# EAGLE design schéma (EAGLE 8.4.0)
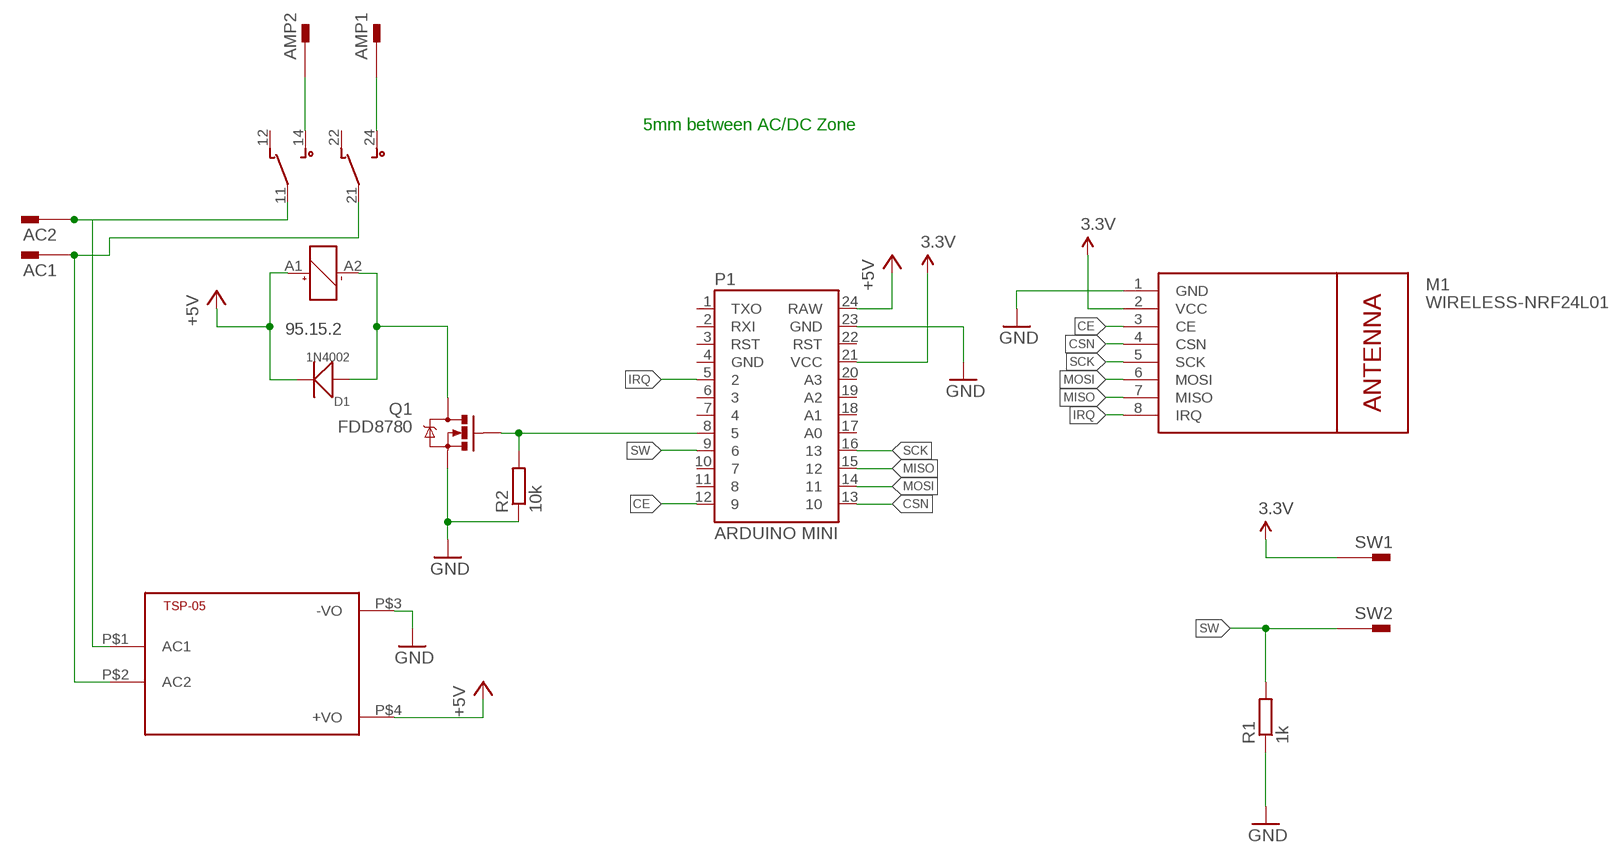
[diagram p0: schematic, sheet 1]

## Parts
AC1  PIN2F061.100  [F061.100]
AC2  PIN2F061.100  [F061.100]
AMP1  PIN2F061.100  [F061.100]
AMP2  PIN2F061.100  [F061.100]
D1  1N4002  DIP-DIODE-50V-1A-1N4001(DO-41)  [DO-41]
M1  WIRELESS-NRF24L01  [WIRELESS-NRF24L01]
P1  ARDUINO MINI  ARDUINO_MINI  [ARDUINO_MINI]
Q1  FDD8780  MOSFET-NCHANNELFDD8780  [DPAK]
R1  1k  R-EU_0207/10  [0207/10]
R2  10k  R-EU_0207/10  [0207/10]
RL1  95.15.2  [95.15.2]
SW1  PIN2F061.100  [F061.100]
SW2  PIN2F061.100  [F061.100]
TSP-05  HKLPM01  [HKLPM01]

## Nets
3.3V: M1.2(VCC) P1.21(VCC) SW1.A1 SW1.A2
+5V: D1.2(-) P1.24(RAW) RL1.A1 TSP-05.P$4(+VO)
CE: M1.3(CE) P1.12
CSN: M1.4(CSN) P1.13
GND: M1.1(GND) P1.23(GND) Q1.3(S) R1.1 R2.1 TSP-05.P$3(-VO)
IRQ: M1.8(IRQ) P1.5
MISO: M1.7(MISO) P1.15
MOSI: M1.6(MOSI) P1.14
N$1: AC1.A1 AC1.A2 RL1.21 TSP-05.P$2(AC2)
N$2: AC2.A1 AC2.A2 RL1.11 TSP-05.P$1(AC1)
N$3: AMP2.A1 AMP2.A2 RL1.14
N$4: AMP1.A1 AMP1.A2 RL1.24
N$5: P1.8 Q1.1(G) R2.2
N$6: D1.1(+) Q1.4(D) RL1.A2
SCK: M1.5(SCK) P1.16
SW: P1.9 R1.2 SW2.A1 SW2.A2
Unconnected: P1.1(TXO) P1.2(RXI) P1.3(RST) P1.4(GND) P1.6 P1.7 P1.10 P1.11 P1.17(A0) P1.18(A1) P1.19(A2) P1.20(A3) P1.22(RST) RL1.12 RL1.22

## Notes on the sheet
- 5mm between AC/DC Zone

## Library data of the parts
AC1 AC2 AMP1 AMP2 SW1 SW2 = con-faston:PIN2: Flachstecker Typ Tyco/Electronics/AMP TAB, FASTON Printed Circuit Board Tabs Source: http://www.buerklin.com, http://catalog.tycoelectronics.com; OC_FARNELL: unknown; OC_NEWARK: unknown
D1 = Seeed-OPL-Diode:DIP-DIODE-50V-1A-1N4001(DO-41): 304010006; MPN: 1N4001; VALUE: 1N4001
M1 = nRF24:WIRELESS-NRF24L01: 2.4 GHz Wireless Module based on NRF24L01 chip More details available here: http://www.electrodragon.com/w/NRF24L01 Click here to find device on ebay.com <http://www.ebay.com/sch/nrf24l01+arduino>
P1 = SparkFun-Boards:ARDUINO_MINI: Arduino Pro Mini footprint
Q1 = SparkFun-DiscreteSemi:MOSFET-NCHANNEL: Common NMOSFET Parts MFG P/N Store ID Prod ID FDD8780 TRANS-09984 SI7820DN TRANS-11055 FDS6630A IC-08089 2N7002PW TRANS-11151 FQP30N06L COM-10213 TRANS-10060 BSS123LT1G TRANS-08345 BSS138 TRANS-00830 BS170 2N7000; PROD_ID: TRANS-09984
R1 R2 = resistor:R-EU_: RESISTOR, European symbol
RL1 = relay_finder:95.15.2: P.C.B. socket suitable for the 40.51 & 40.52 & 40.61 relays
TSP-05 = HKLPM01:HKLPM01

## Board
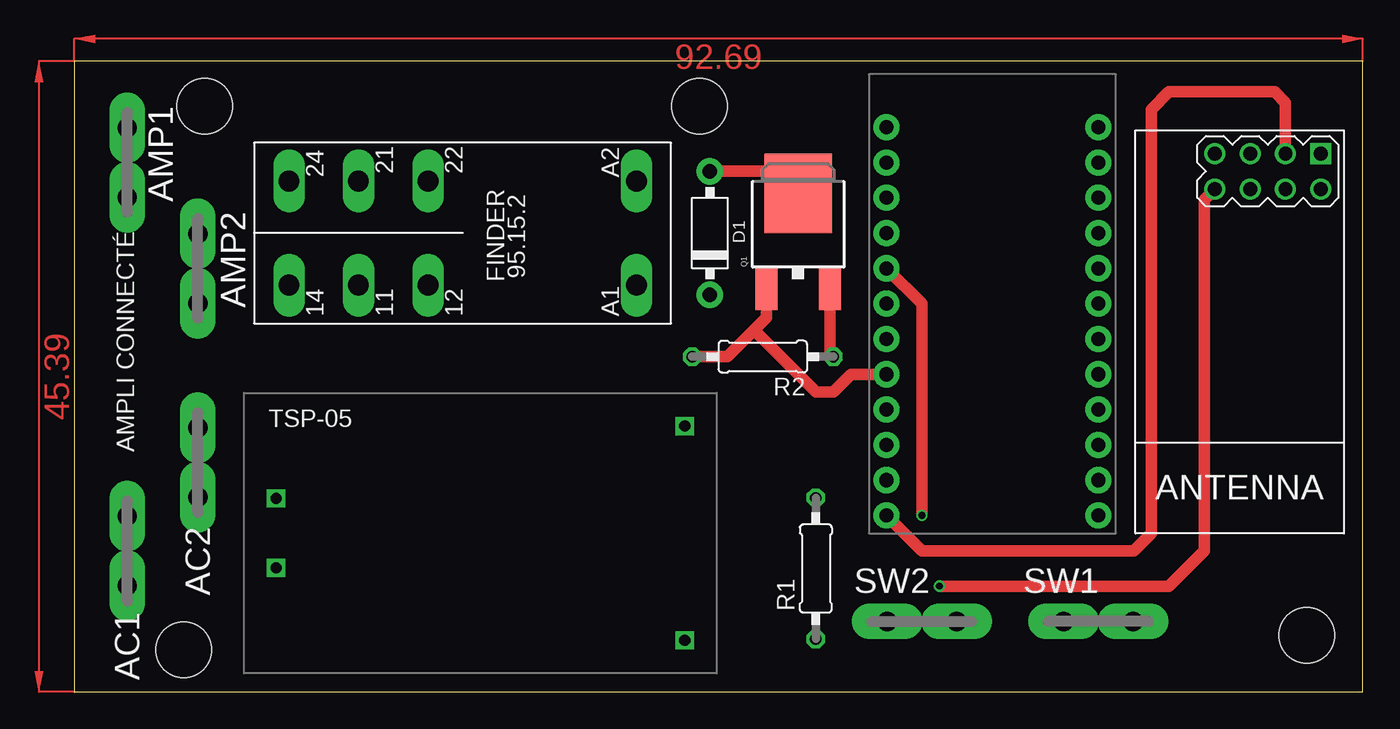
[diagram p1: board, top side]
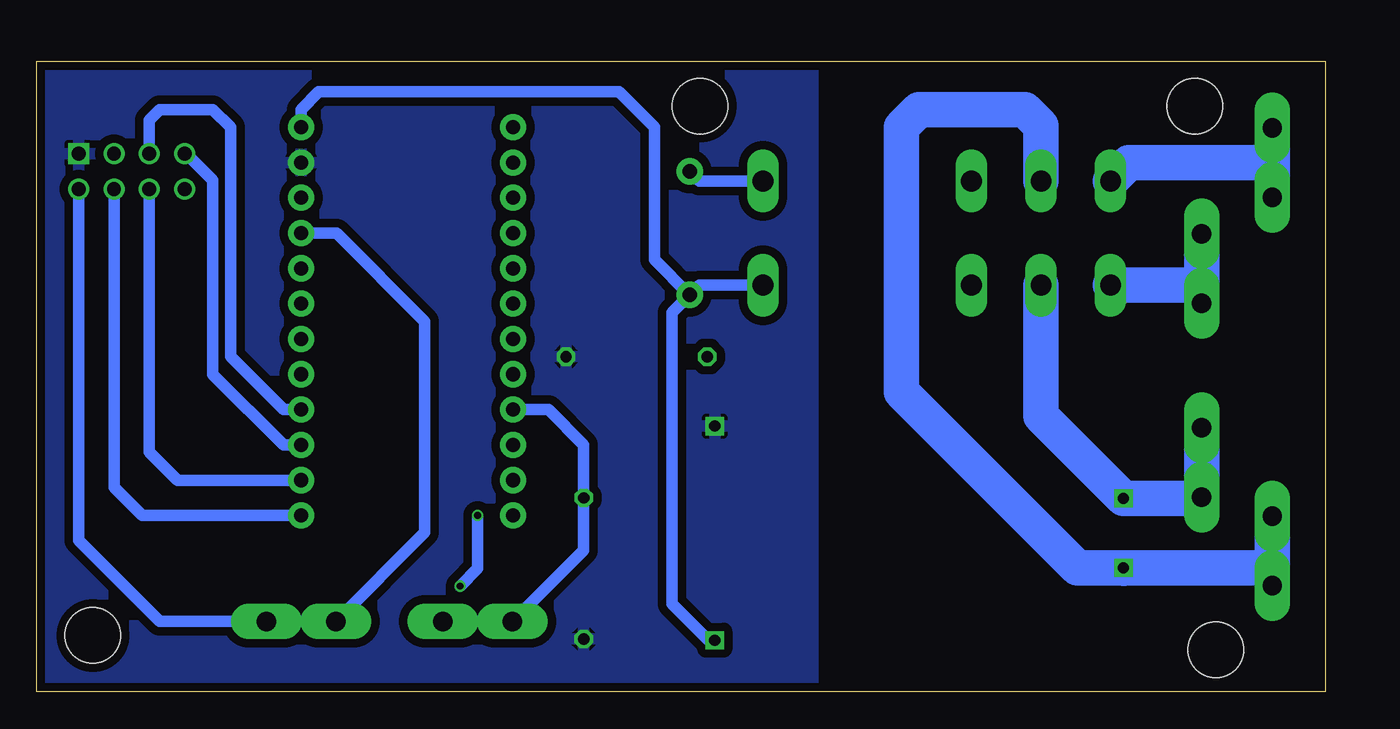
[diagram p2: board, bottom side, seen from below]

Size 92.69 x 45.39 mm. Coordinates in mm from the lower left corner, seen from the top.
Outline: 0,0 92.69,0 92.69,45.39 0,45.39 0,0
Copper layers (1*16): Top 0.035mm / dielectric 1.5mm / Bottom 0.035mm
Design rules "SeeedStudio_2layer_DRU_no_angle_20140221": minimum track width 6mil, minimum drill 12mil, track to track 6mil, track to pad 6mil, pad to pad 6mil, via to via 6mil, smd to smd 0mil, copper to edge 10mil, drill to drill 10mil, minimum pad ring 10mil, minimum via ring 6mil, stop-mask expansion 2mil, vias tented up to drill 100mil, thermal gap 10mil
Holes 4 mm at 9.4,42.16 7.87,3.05 44.96,42.16 88.65,4.06

### Footprints (pad centres in the part's own frame; a part is rotated, then mirrored left to right if it is on the bottom)
F061.100 = drill 1.4 pad 2.54 long: A1 -2.5,0; A2 2.5,0
DO-41 = drill 1.041 pad 1.905: 1 -4.445,0; 2 4.445,0
WIRELESS-NRF24L01 = drill 1 square: 1 -12.7,6.35 | drill 1: 2 -10.16,6.35; 3 -12.7,3.81; 4 -10.16,3.81; 5 -12.7,1.27; 6 -10.16,1.27; 7 -12.7,-1.27; 8 -10.16,-1.27
ARDUINO_MINI = drill 1.016 pad 1.88: 1 -7.62,12.7; 2 -7.62,10.16; 3 -7.62,7.62; 4 -7.62,5.08; 5 -7.62,2.54; 6 -7.62,0; 7 -7.62,-2.54; 8 -7.62,-5.08; 9 -7.62,-7.62; 10 -7.62,-10.16; 11 -7.62,-12.7; 12 -7.62,-15.24; 13 7.62,-15.24; 14 7.62,-12.7; 15 7.62,-10.16; 16 7.62,-7.62; 17 7.62,-5.08; 18 7.62,-2.54; 19 7.62,0; 20 7.62,2.54; 21 7.62,5.08; 22 7.62,7.62; 23 7.62,10.16; 24 7.62,12.7
DPAK = smd 1.6 x 3: 1 -2.28,-5.31; 3 2.28,-5.31 | smd 4.826 x 5.715: 4 0,1.588
0207/10 = drill 0.813 octagon: 1 -5.08,0; 2 5.08,0
95.15.2 = drill 1.5 long: 11 -3.75,7.5; 12 -3.75,2.5; 14 -3.75,12.5; 21 3.75,7.5; 22 3.75,2.5; 24 3.75,12.5; A1 -3.75,-12.5; A2 3.75,-12.5
HKLPM01 = drill 0.8 square: P$1 -14.7,2.5; P$2 -14.7,-2.5; P$3 14.7,7.7; P$4 14.7,-7.7

### Placement (x,y rotation side)
AC1  3.81,10.16 90 top
AC2  8.89,16.51 90 top
AMP1  3.81,38.1 90 top
AMP2  8.89,30.48 90 top
D1  45.72,33.02 270 top
M1  83.31,26.04 270 top
P1  66.04,27.94 0 top
Q1  52.07,34.29 0 top
R1  53.34,8.89 90 top
R2  49.53,24.13 180 top
RL1  27.94,33.02 90 top
SW1  73.66,5.08 180 top
SW2  60.96,5.08 0 top
TSP-05  29.21,11.43 0 top

### Tracks (layer width: path | path; a pad name or v marks a point on that pad's centre or on a via)
3.3V
  Bottom 0.813: P1.21 71.12,33.02 64.77,26.67 64.77,11.47 SW1.A2 76.2,5.08 | M1.2 89.66,10.92 83.82,5.08 76.2,5.08 | 76.2,5.08 SW1.A1
+5V
  Bottom 0.813: RL1.A1 45.02,29.27 D1.2 | D1.2 46.99,27.3 46.99,6.35 44.37,3.73 TSP-05.P$4 | P1.24 73.66,41.91 72.39,43.18 50.8,43.18 48.26,40.64 48.26,31.11 D1.2
CE
  Top 0.813: M1.3 87.12,42.42 86.36,43.18 78.74,43.18 77.47,41.91 77.47,11.43 76.2,10.16 60.96,10.16 P1.12
CSN
  Bottom 0.813: P1.13 85.09,12.7 87.12,14.73 M1.4
GND
  Top 0.813: R2.1 54.35,24.39 Q1.3
  pour Bottom (isolate 0.61): 36.83,45.72 36.83,0 92.71,0 92.71,45.72
IRQ  (via drill 0.5)
  Top 0.813: M1.8 81.28,35.43 81.28,10.16 78.74,7.62 v62.23,7.62 | v60.96,12.7 60.96,27.94 P1.5
  Bottom 0.813: v62.23,7.62 60.96,8.89 v60.96,12.7
MISO
  Bottom 0.813: M1.7 81.92,38.73 80.01,36.83 80.01,22.86 74.93,17.78 P1.15
MOSI
  Bottom 0.813: M1.6 84.58,17.27 82.55,15.24 P1.14
N$1
  Bottom 2.54: 14.47,8.89 TSP-05.P$2 | TSP-05.P$2 17.82,8.93 30.48,21.59 30.48,40.64 29.21,41.91 21.59,41.91 20.44,40.76 RL1.21 | TSP-05.P$2 3.85,8.93 3.81,8.89 AC1.A1 AC1.A2
N$2
  Bottom 2.54: RL1.11 20.44,19.86 TSP-05.P$1 8.97,13.93 AC2.A1 AC2.A2
N$3
  Bottom 2.54: RL1.14 8.95,29.27 8.89,29.21 AMP2.A1 AMP2.A2
N$4
  Bottom 2.54: RL1.24 14.11,38.1 3.81,38.1 | 3.81,38.1 AMP1.A2 | AMP1.A1 3.81,38.1
N$5
  Top 0.813: R2.2 46.99,24.13 48.89,26.04 | 48.89,26.04 49.79,26.93 Q1.1 | P1.8 55.88,22.86 54.61,21.59 53.34,21.59 48.89,26.04
N$6
  Top 0.813: Q1.4 50.48,37.47 D1.1
  Bottom 0.813: RL1.A2 45.02,36.77 D1.1
SCK
  Bottom 0.813: M1.5 84.58,41.15 83.82,41.91 80.01,41.91 78.74,40.64 78.74,24.13 74.93,20.32 P1.16
SW
  Bottom 0.813: P1.9 55.88,20.32 53.34,17.78 R1.2 53.34,10.2 SW2.A1 SW2.A2
(copper drawn outside any net)
  shapes: Top area x2

### Text on the board
tNames: AMPLI CONNECTÉ